# Altium schematic sheet mcuA.SCHDOC: LiveDesign Evaluation - Video Games
size A; Organization: Altium Limited; Address1: L3, 12a Rodborough Rd; Address2: Frenchs Forest; Address3: NSW; Address4: Australia 2086; DocumentNumber: 2; SheetNumber: 2; SheetTotal: 11
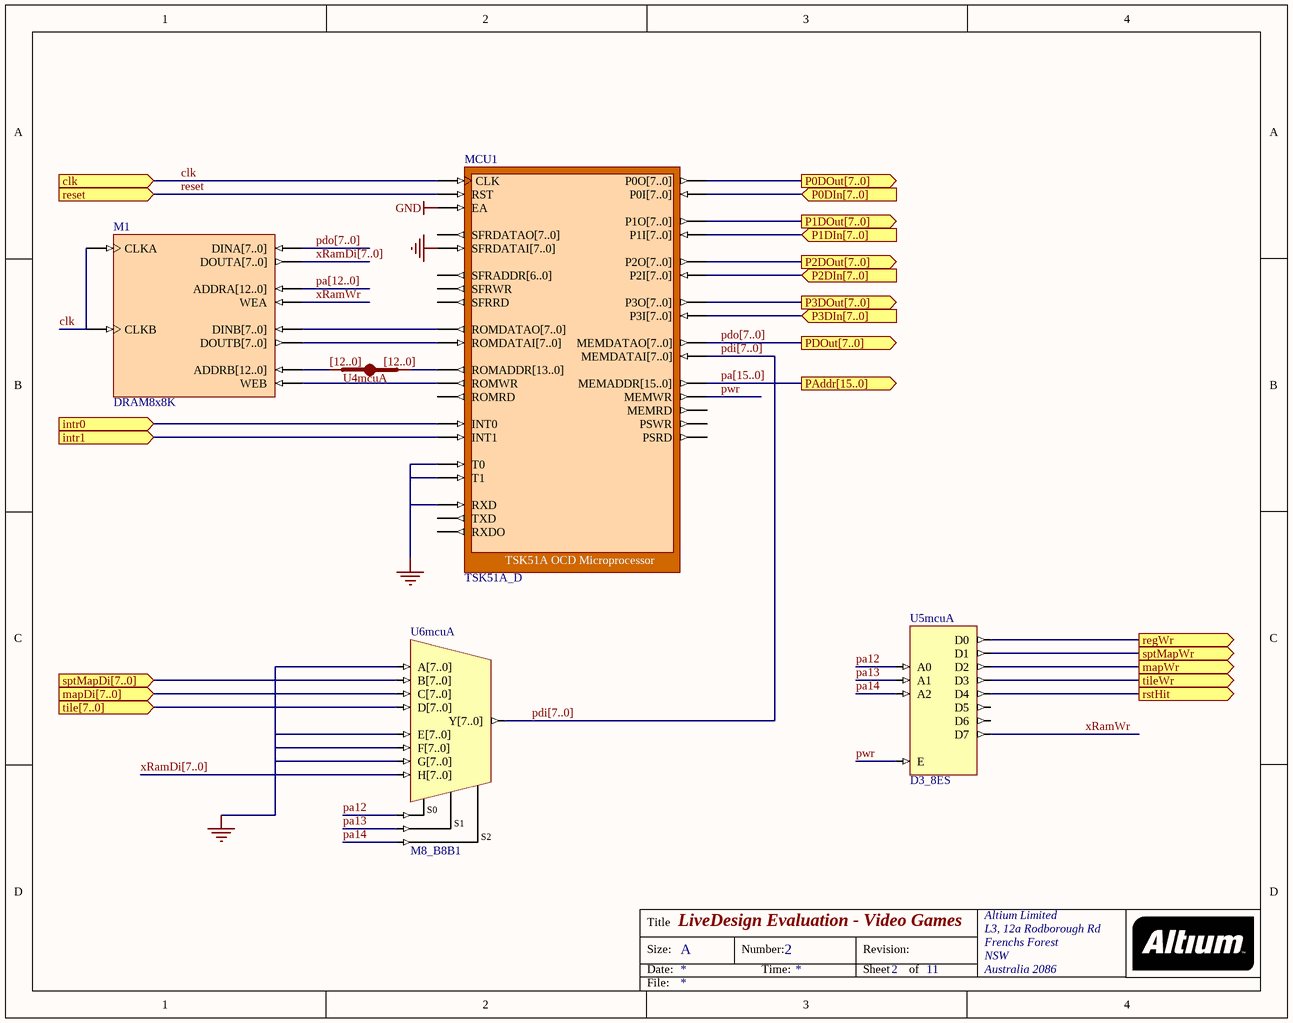
[diagram p0: mcuA.SCHDOC]

## Parts
M1  DRAM8x8K
MCU1  TSK51A_D
U4mcuA  IndexA: [12..0]  (hidden comment: JB)
U5mcuA  D3_8ES
U6mcuA  M8_B8B1

## Ports
clk (in), intr0 (in), intr1 (in), mapDi[7..0] (in), mapWr (out), P0DIn[7..0] (in), P0DOut[7..0] (out), P1DIn[7..0] (in), P1DOut[7..0] (out), P2DIn[7..0] (in), P2DOut[7..0] (out), P3DIn[7..0] (in), P3DOut[7..0] (out), PAddr[15..0] (out), PDOut[7..0] (out), regWr (out), reset (in), rstHit (out), sptMapDi[7..0] (in), sptMapWr (out), tile[7..0] (in), tileWr (out)

## Nets
GND: MCU1.EA MCU1.RXD MCU1.T0 MCU1.T1
GNDBUS[..]: MCU1.SFRDATAI[7..0] U6mcuA.A[7..0] U6mcuA.E[7..0] U6mcuA.F[7..0] U6mcuA.G[7..0]
clk: M1.CLKA M1.CLKB MCU1.CLK ; port clk
intr0: MCU1.INT0 ; port intr0
intr1: MCU1.INT1 ; port intr1
mapDi[7..0]: U6mcuA.C[7..0] ; port mapDi[7..0]
mapWr: U5mcuA.D2 ; port mapWr
P0DIn[7..0]: MCU1.P0I[7..0] ; port P0DIn[7..0]
P0DOut[7..0]: MCU1.P0O[7..0] ; port P0DOut[7..0]
P1DIn[7..0]: MCU1.P1I[7..0] ; port P1DIn[7..0]
P1DOut[7..0]: MCU1.P1O[7..0] ; port P1DOut[7..0]
P2DIn[7..0]: MCU1.P2I[7..0] ; port P2DIn[7..0]
P2DOut[7..0]: MCU1.P2O[7..0] ; port P2DOut[7..0]
P3DIn[7..0]: MCU1.P3I[7..0] ; port P3DIn[7..0]
P3DOut[7..0]: MCU1.P3O[7..0] ; port P3DOut[7..0]
pa12: U5mcuA.A0 U6mcuA.S0
pa13: U5mcuA.A1 U6mcuA.S1
pa14: U5mcuA.A2 U6mcuA.S2
pa[12..0]: M1.ADDRA[12..0]
pa[15..0]: MCU1.MEMADDR[15..0] ; port PAddr[15..0]
pdi[7..0]: MCU1.MEMDATAI[7..0] U6mcuA.Y[7..0]
pdo[7..0]: M1.DINA[7..0] MCU1.MEMDATAO[7..0] ; port PDOut[7..0]
pwr: MCU1.MEMWR U5mcuA.E
regWr: U5mcuA.D0 ; port regWr
reset: MCU1.RST ; port reset
rstHit: U5mcuA.D4 ; port rstHit
sptMapDi[7..0]: U6mcuA.B[7..0] ; port sptMapDi[7..0]
sptMapWr: U5mcuA.D1 ; port sptMapWr
tile[7..0]: U6mcuA.D[7..0] ; port tile[7..0]
tileWr: U5mcuA.D3 ; port tileWr
xRamDi[7..0]: M1.DOUTA[7..0] U6mcuA.H[7..0]
xRamWr: M1.WEA U5mcuA.D7
NetM1_ADDRB[12..0]: M1.ADDRB[12..0] U4mcuA.A[0..0]
NetM1_DINB[7..0]: M1.DINB[7..0] MCU1.ROMDATAO[7..0]
NetM1_DOUTB[7..0]: M1.DOUTB[7..0] MCU1.ROMDATAI[7..0]
NetM1_WEB: M1.WEB MCU1.ROMWR
NetMCU1_ROMADDR[13..0]: MCU1.ROMADDR[13..0] U4mcuA.B[0..0]

Not connected (* = marked no-connect by the designer): MCU1 MEMRD PSRD PSWR ROMRD RXDO SFRADDR[6..0] SFRDATAO[7..0] SFRRD SFRWR TXD; U5mcuA D5 D6

## Buses and harness runs
bus pa[12..0]
bus pa[15..0] = port PAddr[15..0]
bus pdi[7..0]
bus pdo[7..0]
bus pdo[7..0] = port PDOut[7..0]
bus xRamDi[7..0]

## Notes on the sheet
- Labels drawn without touching a wire or pin: GNDBUS[..]
- Title
- Size:
- Date:
- A
- Number:
- Time:
- Revision:
- Sheet
- of
- File:

## Library data of the parts
M1 = DRAM8x8K: Dual Port Random Access Memory 8192 x 8 and 8192 x 8; Memory_DepthA: 8192; Memory_Type: RAM_DualPortBlock; Memory_WidthA: 8; Memory_ClockEdge: Rising; Nexus_Core: Memory_Program; Published: 26/09/2003; Publisher: Altium Hobart Technology Center; Memory_DepthB: 8192; Memory_WidthB: 8
MCU1 = TSK51A_D: TSK51A OCD Microprocessor; NEXUS_CORE: Processor_OCDS; NEXUS_JTAG_DEVICE: True; NEXUS_JTAG_ORDER: 0; ChildModel1: RAM256x8_TSK51D; ChildCore1: M1; Memory_Configuration: Record[NEXUS_CORE]{}ComponentDesignator[iram]{}Memory_Depth[256]{}Memory_UsageType[ram]{}ProgramDownloadAddress[0x0]{}Memory_BusType[c51:idata_bus]{n}Record[NEXUS_CORE]{}ComponentDesignator[xram]{}Memory_Depth[2k]{}Memory_UsageType[ram]{}ProgramDownloadAddress[0x7800]{}Memory_BusType[c51:xdata_bus]{n}Record[NEXUS_CORE]{}ComponentDesignator[xrom]{}Memory_Depth[6k]{}Memory_UsageType[rom]{}ProgramDownloadAddress[0x0]{}Memory_BusType[c51:code_bus]{n}; Published: 23/10/2003; Publisher: Altium Hobart Technology Centre; Core Revision: 1.00.00
U4mcuA = JB: System BUS Joiner; ArchiveName: GENERIC; Published: 18-Dec-2003; Publisher: Altium Limited; Core Revision: 1.00.00; IndexB: [12..0]
U5mcuA = D3_8ES: Binary 3- to 8-Bit Decoder with Enable, Single Pin Version; Xilinx Equivalent: D3_8E; ArchiveName: GENERIC; Published: 9-30-2003; Publisher: Altium Limited; Core Revision: 1.00.00
U6mcuA = M8_B8B1: 8x8-Bit Bus to 1x8-Bit Bus Multiplexer; ArchiveName: GENERIC; Published: 9-30-2003; Publisher: Altium Limited; Core Revision: 1.00.00